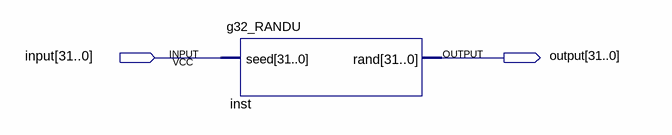
[diagram p0: schematic sheet]
// Quartus schematic test.bdf as structural Verilog: 1 symbols, 2 pins
module test (
  input  [31:0] \input ,
  output [31:0] \output 
);

  g32_RANDU inst (.seed(\input ), .\rand (\output ));
endmodule
